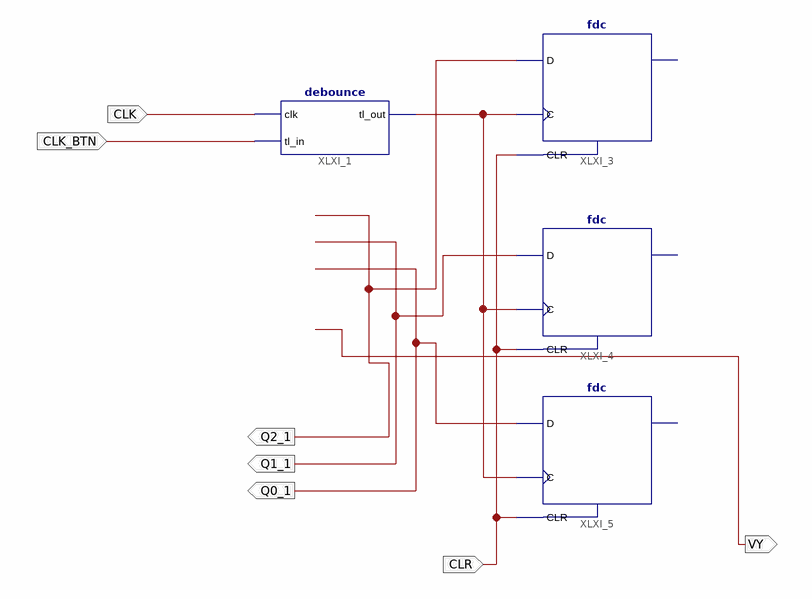
[diagram p0: schematic sheet 1]
// Xilinx ISE schematic modulo6.sch (spartan3e) as structural Verilog: 4 symbols, 7 ports
module modulo6 (
  input  CLR,
  input  CLK,
  input  CLK_BTN,
  output Q2_1,
  output Q1_1,
  output Q0_1,
  output VY
);

  wire XLXN_8;

  fdc XLXI_4 (.C(XLXN_8), .CLR(CLR), .D(Q1_1));  // open: Q
  fdc XLXI_3 (.C(XLXN_8), .CLR(CLR), .D(Q2_1));  // open: Q
  debounce XLXI_1 (.clk(CLK), .tl_in(CLK_BTN), .tl_out(XLXN_8));
  fdc XLXI_5 (.C(XLXN_8), .CLR(CLR), .D(Q0_1));  // open: Q
endmodule
